# EAGLE design 304_usb_serial020000 (EAGLE 9.6.2)
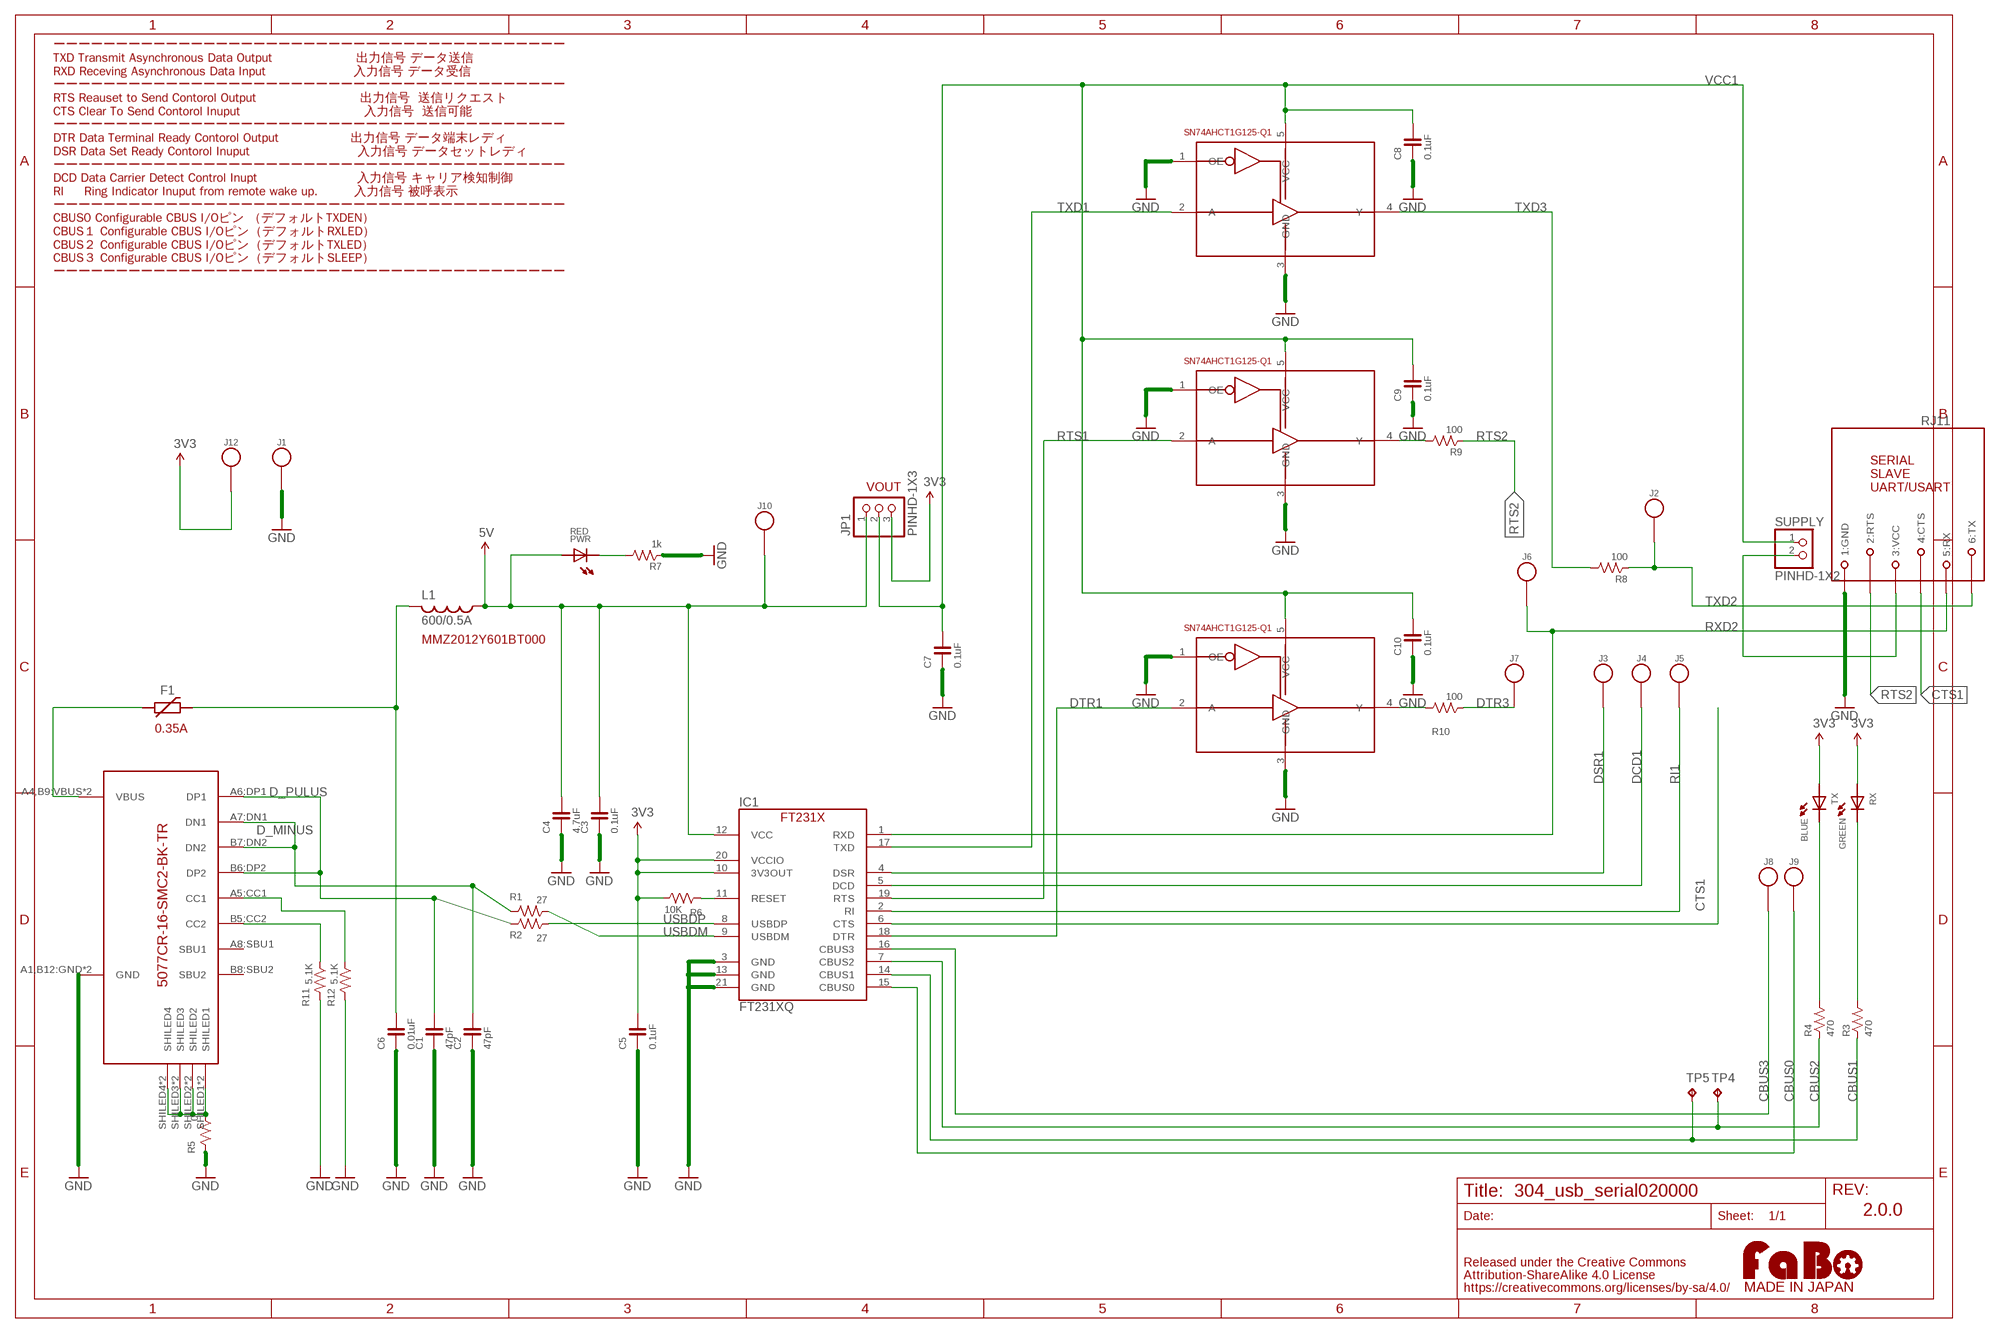
[diagram p0: schematic, sheet 1]

## Parts
C1  47pF  CAPACITOR-0603_NARROW  [0603-NARROW]
C2  47pF  CAPACITOR-0603_NARROW  [0603-NARROW]
C3  0.1uF  CAPACITOR-0603_NARROW  [0603-NARROW]
C4  4.7uF  CAPACITOR-0603_NARROW  [0603-NARROW]
C5  0.1uF  CAPACITOR-0603_NARROW  [0603-NARROW]
C6  0.01uF  CAPACITOR-0603_NARROW  [0603-NARROW]
C7  0.1uF  CAPACITOR-0603_NARROW  [0603-NARROW]
C8  0.1uF  CAPACITOR-0402-NO_SILK  [0402-NO_SILK]
C9  0.1uF  CAPACITOR-0402-NO_SILK  [0402-NO_SILK]
C10  0.1uF  CAPACITOR-0402-NO_SILK  [0402-NO_SILK]
F1  350mA  POLYSWITCH  [NANOSMDC035F]
IC1  FT231XQ  [QFN-20_FT231X]
J1  PIN_HEADER_1X1_NOLABEL_C  [PIN_1X1_NOLABEL]
J2  PIN_HEADER_1X1_NOLABEL_C  [PIN_1X1_NOLABEL]
J3  PIN_HEADER_1X1_NOLABEL_C  [PIN_1X1_NOLABEL]
J4  PIN_HEADER_1X1_NOLABEL_C  [PIN_1X1_NOLABEL]
J5  PIN_HEADER_1X1_NOLABEL_C  [PIN_1X1_NOLABEL]
J6  PIN_HEADER_1X1_NOLABEL_C  [PIN_1X1_NOLABEL]
J7  PIN_HEADER_1X1_NOLABEL_C  [PIN_1X1_NOLABEL]
J8  PIN_HEADER_1X1_NOLABEL_C  [PIN_1X1_NOLABEL]
J9  PIN_HEADER_1X1_NOLABEL_C  [PIN_1X1_NOLABEL]
J10  PIN_HEADER_1X1_NOLABEL_C  [PIN_1X1_NOLABEL]
J12  PIN_HEADER_1X1_NOLABEL_C  [PIN_1X1_NOLABEL]
JP1  PINHD-1X3  [1X03]
L1  600/0.5A  INDUCTOR_0805_L  [RESC0805_L]
PWR  RED  LED-0603-NARROW  [0603-NARROW]
R1  27  RESISTOR-0603-NARROW  [0603-NARROW]
R2  27  RESISTOR-0603-NARROW  [0603-NARROW]
R3  470  RESISTOR-0603-NARROW  [0603-NARROW]
R4  470  RESISTOR-0603-NARROW  [0603-NARROW]
R5  0  RESISTOR-0603-NARROW  [0603-NARROW]
R6  10K  RESISTOR-0603-NARROW  [0603-NARROW]
R7  1k  RESISTOR-0603-NARROW  [0603-NARROW]
R8  100  RESISTOR-0603-NARROW  [0603-NARROW]
R9  100  RESISTOR-0603-NARROW  [0603-NARROW]
R10  100  RESISTOR-0603-NARROW  [0603-NARROW]
R11  5.1K  RESISTOR-0603-NARROW  [0603-NARROW]
R12  5.1K  RESISTOR-0603-NARROW  [0603-NARROW]
RJ11  MODULAR-JACK-6P-RJ11_SERIAL_S_USART  [7002-6PXC-X]
RX  GREEN  LED-0603-NARROW  [0603-NARROW]
SUPPLY  PINHD-1X2  [1X02]
TP4  TPB0,65  [B0,65]
TP5  TPB0,65  [B0,65]
TX  BLUE  LED-0603-NARROW  [0603-NARROW]
U$2  LOGO_FABO-M_BOTTOM  [LOGO_FABO_MS_BOTTOM]
U$4  5077CR-16-SMC2-BK-TR  [5077CR-16-SMC2-BK-TR]
U$6  SN74AHCT1G125-Q1  [SC70]
U$7  SN74AHCT1G125-Q1  [SC70]
U$8  SN74AHCT1G125-Q1  [SC70]

## Nets
3V3: C5.2 IC1.10(3V3OUT) IC1.20(VCCIO) J12.1 JP1.3 R6.1 RX.ANODE TX.ANODE
5V: C3.2 C4.2 IC1.12(VCC) J10.1 JP1.1 L1.1 PWR.ANODE
CBUS0: IC1.15(CBUS0) J9.1
CBUS1: IC1.14(CBUS1) R3.1 TP5.TP
CBUS2: IC1.7(CBUS2) R4.1 TP4.TP
CBUS3: IC1.16(CBUS3) J8.1
CTS1: IC1.6(CTS) RJ11.4(4:CTS)
D_MINUS: C2.2 R1.2 U$4.A7:DN1(DN1) U$4.B7:DN2(DN2)
D_PULUS: C1.2 R2.2 U$4.A6:DP1(DP1) U$4.B6:DP2(DP2)
DCD1: IC1.5(DCD) J4.1
DSR1: IC1.4(DSR) J3.1
DTR1: IC1.18(DTR) U$8.2(A)
DTR3: J7.1 R10.1
GND: C1.1 C2.1 C3.1 C4.1 C5.1 C6.1 C7.1 C8.1 C9.1 C10.1 IC1.3(GND) IC1.13(GND) IC1.21(GND) J1.1 R5.2 R7.1 R11.2 R12.2 RJ11.1(1:GND) U$4.A1,B12:GND(GND) U$4.B1,A12:GND(GND) U$6.1(OE) U$6.3(GND) U$7.1(OE) U$7.3(GND) U$8.1(OE) U$8.3(GND)
N$1: R9.2 U$7.4(Y)
N$2: C6.2 F1.2 L1.2
N$3: R11.1 U$4.B5:CC2(CC2)
N$4: R12.1 U$4.A5:CC1(CC1)
N$5: PWR.CATHODE R7.2
N$8: R10.2 U$8.4(Y)
N$15: IC1.11(RESET) R6.2
N$33: R3.2 RX.CATHODE
N$35: R4.2 TX.CATHODE
RI1: IC1.2(RI) J5.1
RTS1: IC1.19(RTS) U$7.2(A)
RTS2: R9.1 RJ11.2(2:RTS)
RXD2: IC1.1(RXD) J6.1 RJ11.5(5:RX)
SHILED: R5.1 U$4.SHILED1 U$4.SHILED2 U$4.SHILED3 U$4.SHILED4 U$4.SHILED5(SHILED1) U$4.SHILED6(SHILED2) U$4.SHILED7(SHILED3) U$4.SHILED8(SHILED4)
TXD1: IC1.17(TXD) U$6.2(A)
TXD2: J2.1 R8.1 RJ11.6(6:TX)
TXD3: R8.2 U$6.4(Y)
USBDM: IC1.9(USBDM) R1.1
USBDP: IC1.8(USBDP) R2.1
VBUS: F1.1 U$4.A4,B9:VBUS(VBUS) U$4.B4,A9:VBUS(VBUS)
VCC1: C7.2 C8.2 C9.2 C10.2 JP1.2 SUPPLY.1 U$6.5(VCC) U$7.5(VCC) U$8.5(VCC)
VCC2: RJ11.3(3:VCC) SUPPLY.2
Unconnected: U$4.A8:SBU1(SBU1) U$4.B8:SBU2(SBU2)

## Notes on the sheet
- ーーーーーーーーーーーーーーーーーーーーーーーーーーーーーーーーーーーーーーーーー
  TXD Transmit Asynchronous Data Output                     出力信号 データ送信
  RXD Receving Asynchronous Data Input                      入力信号 データ受信
  ーーーーーーーーーーーーーーーーーーーーーーーーーーーーーーーーーーーーーーーーー
  RTS Reauset to Send Contorol Output                          出力信号  送信リクエスト
  CTS Clear To Send Contorol Inuput                               入力信号  送信可能 
  ーーーーーーーーーーーーーーーーーーーーーーーーーーーーーーーーーーーーーーーーー
  DTR Data Terminal Ready Contorol Output                  出力信号 データ端末レディ
  DSR Data Set Ready Contorol Inuput                           入力信号 データセットレディ
  ーーーーーーーーーーーーーーーーーーーーーーーーーーーーーーーーーーーーーーーーー
  DCD Data Carrier Detect Control Inupt                         入力信号 キャリア検知制御
  RI     Ring Indicator Inuput from remote wake up.         入力信号 被呼表示
  ーーーーーーーーーーーーーーーーーーーーーーーーーーーーーーーーーーーーーーーーー
  CBUS0 Configurable CBUS I/Oピン （デフォルトTXDEN）
  CBUS１ Configurable CBUS I/Oピン（デフォルトRXLED）
  CBUS２ Configurable CBUS I/Oピン（デフォルトTXLED）
  CBUS３ Configurable CBUS I/Oピン（デフォルトSLEEP）
  ーーーーーーーーーーーーーーーーーーーーーーーーーーーーーーーーーーーーーーーーー
- VOUT
- MMZ2012Y601BT000
- 0.35A
- 2.0.0

## Library data of the parts
C1-C10 = FaBo-Capacitor:CAPACITOR: CAPACITOR
F1 = FaBo-Parts:POLYSWITCH
IC1 = FaBo-USB:FT231X
J1-J10 J12 = FaBo-PIN:PIN_HEADER_1X1_NOLABEL_C
JP1 = Connector:PINHD-1X3: PIN HEADER; CATEGORY: CONNECTOR; SUB-CATEGORY: PIN-HEADER
L1 = Nordic_nRF:INDUCTOR: Generic chip inductor
PWR RX TX = FaBo-LED:LED
R1-R12 = FaBo-Resistors:RESISTOR: RESISTOR
RJ11 = FaBo-Connetor:MODULAR-JACK-6P-RJ11_SERIAL_S_USART
SUPPLY = Connector:PINHD-1X2: PIN HEADER; CATEGORY: CONNECTOR; SUB-CATEGORY: PIN-HEADER
TP4 TP5 = BeagleBone_Blue_R3:TP: Test pad
U$2 = FaBo-Logo:LOGO_FABO
U$4 = FaBo-USB:5077CR-16-SMC2-BK-TR
U$6-U$8 = FaBo-LevelTranslator:SN74AHCT1G125-Q1: SN74AHCT1G125-Q1 SINGLE BUFFER GATE WITH 3 STATE OUTPUT

## Board
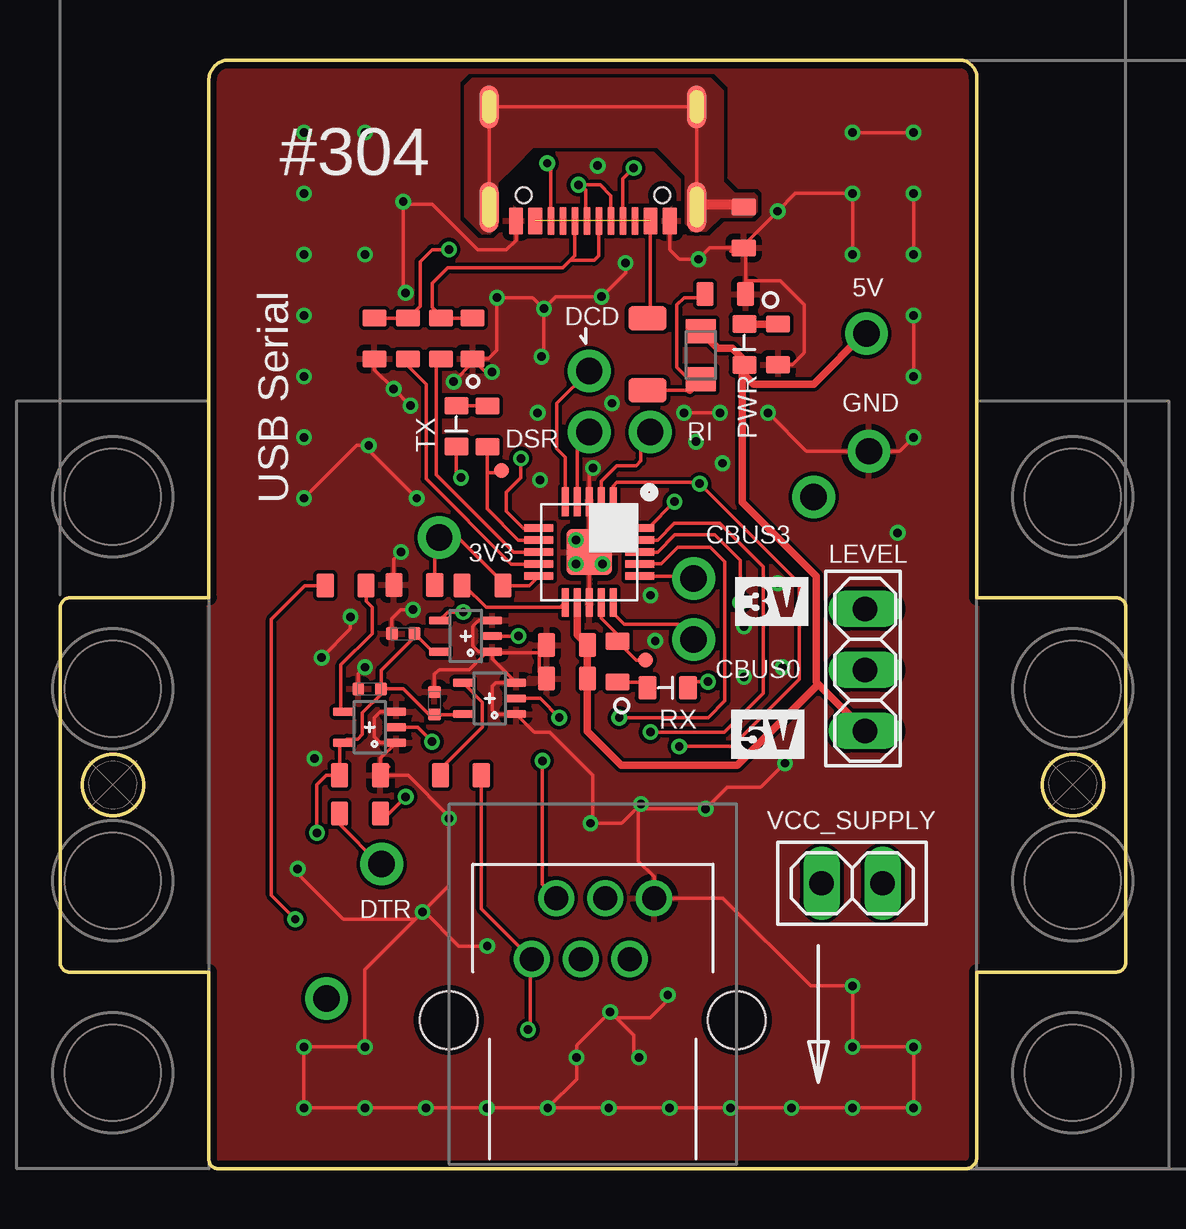
[diagram p1: board, top side]
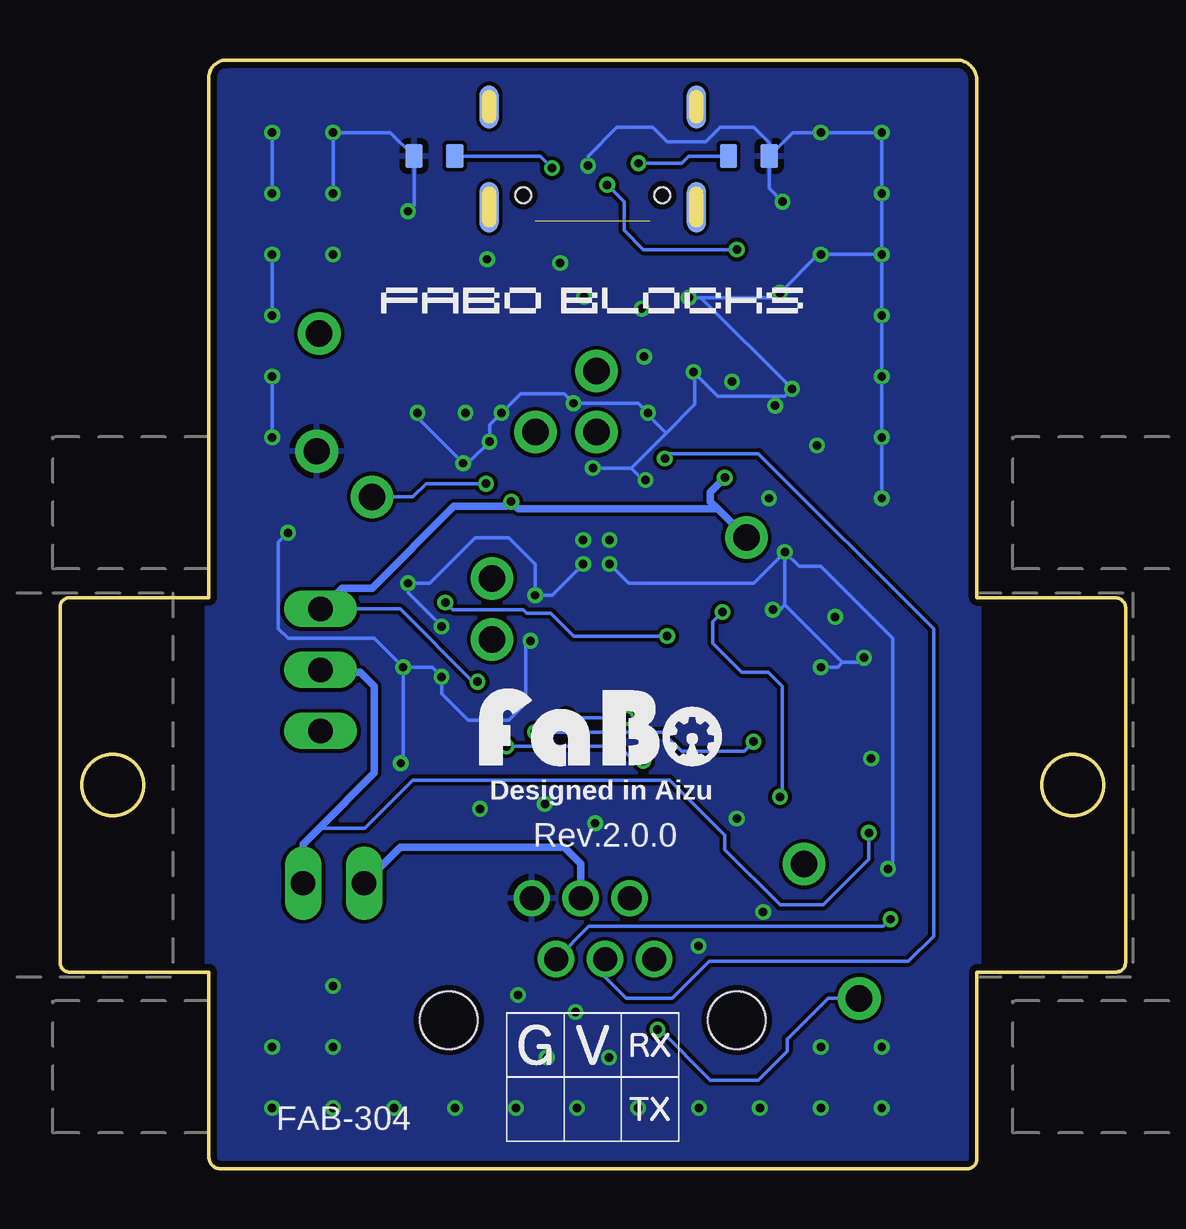
[diagram p2: board, bottom side, seen from below]

Size 44.4 x 46.2 mm. Coordinates in mm from the lower left corner, seen from the top.
Outline: 37.7,0 6.6,0 arc-90 6.2,0.4 6.2,8.2 0.4,8.2 arc-90 0,8.6 0,23.3 arc-90 0.4,23.8 6.2,23.8 6.2,45.4 arc-90 7.1,46.2 37.4,46.2 arc-99 38.2,45.4 38.2,23.8 44,23.8 arc-90 44.4,23.4 44.4,8.6 arc-90 44,8.2 38.2,8.2 38.2,0.5 arc-90 37.7,0
Outline: circle at 42.2,16 radius 1.27
Outline: circle at 2.2,16 radius 1.27
Copper layers (1*16): Top 0.035mm / dielectric 1.5mm / Bottom 0.035mm
Design rules "Elecrow_angle": minimum track width 6mil, minimum drill 12mil, track to track 6mil, track to pad 6mil, pad to pad 6mil, via to via 6mil, smd to smd 0mil, copper to edge 10mil, drill to drill 10mil, minimum pad ring 10mil, minimum via ring 6mil, stop-mask expansion 2mil, vias tented up to drill 100mil, thermal gap 10mil
tRestrict: area 38.3,6.6 to 46,26.2; area -1.6,6.6 to 6.1,26.2
bRestrict: area 38.4,6.6 to 46.1,26.2; area -1.7,6.6 to 6,26.2

### Footprints (pad centres in the part's own frame; a part is rotated, then mirrored left to right if it is on the bottom)
0603-NARROW = smd 0.71 x 1: 1 -0.85,0; 2 0.85,0
0402-NO_SILK = smd 0.5 x 0.55: 1 -0.475,0; 2 0.475,0
NANOSMDC035F = smd 1 x 1.6: 1 -1.5,0; 2 1.5,0
QFN-20_FT231X = smd 1.2 x 0.3: 1 -2.1,1; 2 -2.1,0.5; 3 -2.1,0; 4 -2.1,-0.5; 5 -2.1,-1; 11 2.1,-1; 12 2.1,-0.5; 13 2.1,0; 14 2.1,0.5; 15 2.1,1 | smd 0.3 x 1.2: 6 -1,-2.1; 7 -0.5,-2.1; 8 0,-2.1; 9 0.5,-2.1; 10 1,-2.1; 16 1,2.1; 17 0.5,2.1; 18 0,2.1; 19 -0.5,2.1; 20 -1,2.1 | smd 1.9 x 1.9: 21 0,0
PIN_1X1_NOLABEL = drill 1.1 pad 1.778: 1 0,0
1X03 = drill 1.016 long: 1 -2.54,0; 2 0,0; 3 2.54,0
RESC0805_L = smd 1 x 1.25: 1 -1,0; 2 1,0
0603-NARROW' = smd 0.75 x 1: ANODE -0.85,0; CATHODE 0.85,0
7002-6PXC-X = drill 1: 1 2.55,5.08; 2 1.53,2.54; 3 0.51,5.08; 4 -0.51,2.54; 5 -1.53,5.08; 6 -2.55,2.54 | hole 2.4: -6,0; 6,0
1X02 = drill 1.016 long: 1 -1.27,0; 2 1.27,0
B0,65 = smd 0.635 x 0.635: TP 0,0
5077CR-16-SMC2-BK-TR = smd 0.6 x 1.14: A1,B12:GND -3.2,0; A4,B9:VBUS -2.4,0; B1,A12:GND 3.2,0; B4,A9:VBUS 2.4,0 | smd 0.3 x 1.14: A5:CC1 -1.25,0; A6:DP1 -0.25,0; A7:DN1 0.25,0; A8:SBU1 1.25,0; B5:CC2 1.75,0; B6:DP2 0.75,0; B7:DN2 -0.75,0; B8:SBU2 -1.75,0 | smd 0.8 x 2.1: SHILED1 -4.32,-0.57; SHILED2 4.32,-0.57 | smd 0.8 x 1.8: SHILED3 -4.32,-4.75; SHILED4 4.32,-4.75 | smd 0.8 x 2.1 bottom: SHILED5 -4.32,-0.57; SHILED7 4.32,-0.57 | smd 0.8 x 1.8 bottom: SHILED6 -4.32,-4.75; SHILED8 4.32,-4.75 | hole 0.65: -2.89,-1.07; 2.89,-1.07
SC70 = smd 0.35 x 0.85: 1 -0.65,-1.1; 2 0,-1.1; 3 0.65,-1.1; 4 0.65,1.1; 5 -0.65,1.1

### Placement (x,y rotation side)
C1  17.19,34.6 90 top
C2  13.1,34.6 90 top
C3  21.13,21.82 0 top
C4  21.12,20.43 0 top
C5  14.76,24.34 0 top
C6  27.72,36.45 180 top
C7  12.5,16.4 180 top
C8  12.9,20 0 top
C9  15.6,19.4 270 top
C10  14.3,22.3 0 top
F1  24.48,33.95 270 top
IC1  22.05,25.7 270 top
J1  33.7,29.9 0 top
J2  11.1,7.1 0 top
J3  22.05,30.7 0 top
J4  22.05,33.24 0 top
J5  24.59,30.7 0 top
J6  31.4,28 0 top
J7  13.4,12.7 0 top
J8  26.4,24.6 0 top
J9  26.4,22.06 0 top
J10  33.6,34.8 0 top
J12  15.8,26.3 0 top
JP1  33.55,20.79 90 top
L1  26.7,33.9 270 top
PWR  RED  [0603-NARROW']  28.52,34.34 90 top
R1  14.5,34.6 90 top
R2  15.87,34.6 90 top
R3  23.22,21.14 270 top
R4  17.82,30.93 90 top
R5  28.49,39.23 270 top
R6  17.6,24.3 180 top
R7  29.92,34.35 90 top
R8  16.7,16.4 180 top
R9  11.9,24.3 0 top
R10  12.5,14.8 0 top
R11  15.7,42.2 0 bottom
R12  28.8,42.2 180 bottom
RJ11  22.2,6.2 0 top
RX  GREEN  [0603-NARROW']  25.32,20.05 180 top
SUPPLY  33,11.9 180 top
TP4  18.4,29.1 0 top
TP5  24.4,21.2 0 top
TX  BLUE  [0603-NARROW']  16.52,30.95 90 top
U$2  21.87,16.4 0 top
U$3  [4-1BLOCK]  2.2,16 0 top
U$4  22.2,39.5 180 top
U$5  [4-1BLOCK]  42.2,16 0 top
U$6  17.9,19.6 90 top
U$7  12.9,18.4 90 top
U$8  16.9,22.2 90 top

### Tracks (layer width: path | path; a pad name or v marks a point on that pad's centre or on a via)
3V3  (via drill 0.35)
  Top 0.152: IC1.20 24.5,26.7 v25.6,27.8 | IC1.10 19.55,24.3 R6.1 18.45,24.45 16.6,26.3 J12.1 15.61,26.11 C5.2 | RX.ANODE 26.43,20.3 v27,20.3 | TX.ANODE 16.52,28.98 v16.7,28.8
  Bottom 0.152: v27,20.3 27.2,20.3 30.23,23.33 33.5,23.33 JP1.3
  Bottom 0.305: 33.5,23.33 32.63,24.2 31.4,24.2 28,27.6 25.8,27.6 v25.6,27.8 25.3,27.5 17,27.5 | 17,27.5 17.3,27.8 17.3,28.2 v16.7,28.8 | 17,27.5 J12.1
5V
  Top 0.152: C3.2 21.95,21.85 21.78,22.02 | IC1.12 21.57,23.58 | C4.2 22,20.4 22,20.39
  Top 0.305: 31.6,20.2 31.5,20.3 31.5,24.7 28.42,27.79 28.42,33.19 28.52,33.09 | 31.6,20.2 JP1.1 | PWR.ANODE 28.21,33.49 | IC1.12 21.55,22.25 21.95,21.85 | C3.2 C4.2 22,20.4 | C4.2 21.97,18.23 23.38,16.82 28.22,16.82 31.6,20.2 | J10.1 33.6,34.9 31.4,32.7 28.9,32.7 28.52,33.09 | 28.52,33.09 PWR.ANODE | L1.1 27.4,34.2 28,34.2 28.52,33.69 PWR.ANODE
CBUS0
  Top 0.152: IC1.15 23.1,23.55 23.1,23.1 23.5,22.7 25.76,22.7 J9.1
CBUS1
  Top 0.152: IC1.14 22.55,22.95 23.22,22.28 R3.1 24.01,21.2 TP5.TP
CBUS2
  Top 0.152: 17.82,30.29 R4.1 17.8,30.07 17.8,29 | IC1.7 19.1,26.2 17.8,27.5 17.8,29 | TP4.TP 18.3,29 17.8,29
CBUS3
  Top 0.152: IC1.16 26.3,24.7 J8.1
CTS1  (via drill 0.35)
  Top 0.152: IC1.6 19.3,26.7 18.6,27.4 18.6,28.2 19.2,28.8 v19.2,29.6
  Bottom 0.152: v19.2,29.6 19,29.8 15.3,29.8 8,22.5 8,9.7 9.05,8.65 17.35,8.65 18.9,7.1 20.8,7.1 21.69,7.99 RJ11.4
D_MINUS  (via drill 0.35)
  Top 0.152: C2.2 R1.2 15,35.95 15,37.8 15.51,38.31 v16.2,38.31 | v21.6,41 21.7,41 | 21.7,41 22.5,41 22.95,40.55 U$4.B7:DN2 | U$4.A7:DN1 21.9,39.55 21.9,40.8 21.7,41
  Bottom 0.152: v16.2,38.31 20.11,38.31 20.9,39.1 20.9,40.3 v21.6,41
D_PULUS
  Top 0.152: C1.2 R2.2 15.87,35.53 15.5,35.9 15.5,36.9 16.15,37.55 20.95,37.55 21.25,37.85 | U$4.B6:DP2 21.45,38.05 21.25,37.85 | U$4.A6:DP1 22.45,38.05 22.25,37.85 21.25,37.85
DCD1
  Top 0.152: IC1.5 21.05,29.65 20.7,30 20.7,31.9 J4.1
DSR1
  Top 0.152: IC1.4 21.55,30.2 J3.1
DTR1  (via drill 0.35)
  Top 0.152: IC1.18 24.9,25.7 25.62,26.42 27.28,26.42 28.35,25.36 v28.35,23.6 | U$8.2 v19.1,22.2
  Bottom 0.152: v28.35,23.6 28.05,23.3 25.1,23.3 24.95,23.15 23.95,23.15 23,22.2 v19.1,22.2
DTR3
  Top 0.152: R10.1 11.65,14.35 13.3,12.7 J7.1
GND  (via drill 0.35)
  Top 0.152: 12.95,33.45 12.8,33.45 C2.1 13.1,33.3 v13.9,32.5 v14.6,31.8 | IC1.13 IC1.21 | 19.98,21.5 19.98,21.9 20.28,21.6 C3.1 19.95,21.5 18,21.5 | 19.98,21.5 19.98,20.72 C4.1 | C7.1 13.1,16.65 | 13.7,16.75 C7.1 | 20,20.7 C4.1 | 17.22,33.72 C1.1 17.85,33.75 18.2,34.1 v18.2,36.3 19.7,36.3 v20.16,35.84 | 17.22,33.72 17.74,33.2 v18,33.2 | v22.2,29.2 22.05,29.05 IC1.3 IC1.21 | IC1.21 22.55,26.2 v22.6,26.2 | IC1.21 22.1,25.7 v22.6,25.2 | IC1.21 21.55,25.2 v21.5,25.2 | v14.2,25.7 13.91,25.41 C5.1 | 30.5,33.5 30.5,33.51 R7.1 30.51,33.51 31,34 31,36 30,37 28.57,37 | v9.9,12.5 9.9,12.3 11.8,10.4 14.8,10.4 v15.1,10.7 | IC1.21 21.55,26.2 v21.5,26.2 | v26,31.5 v27.5,31.5 | v30.2,16.9 29.2,15.9 27.8,15.9 v26.9,15 24.4,15 v24.2,15.2 | v24.2,15.2 23.4,14.4 22.2,14.4 | 22.2,14.4 v22.1,14.4 | v24.2,15.2 24.1,15.1 24.1,12.82 24.75,12.18 RJ11.1 27.62,11.28 31.28,7.62 v33.02,7.62 v33.02,5.08 v35.56,5.08 v35.56,2.54 v33.02,2.54 v30.48,2.54 v27.94,2.54 v25.4,2.54 v22.86,2.54 v20.32,2.54 | 14.28,36.38 v14.4,36.5 14.3,36.6 14.3,40.2 | v16.4,32.8 17.22,33.62 17.22,33.72 | 15.15,10.75 16.2,11.8 v16.2,14.6 16.2,14.7 14.5,16.4 C7.1 | 15.15,10.75 v15.1,10.7 | 20.1,20.6 C4.1 | 19.8,21.5 19.98,21.5 | 17.8,21.55 U$8.1 18,21.5 | 17.8,21.55 17.45,21.55 17.2,21.8 17.2,22.6 17.45,22.85 U$8.3 | U$7.3 13.35,19.05 13.1,18.8 13.1,18 13.35,17.75 U$7.1 13.35,17.1 C7.1 | C10.1 13.83,22.93 14.2,23.3 v14.7,23.3 | C8.1 12.43,20.62 v12.7,20.9 | 18,21.5 18,21.25 U$6.3 18.15,20.25 18,20.1 18,19.1 18.15,18.95 U$6.1 19.75,18.2 20.4,18.2 22.2,16.4 22.2,14.4 | v12.1,23 12.1,22.5 v10.9,21.3 | C9.1 15.6,20.6 15.8,20.8 17.05,20.8 17.8,21.55 | U$4.A1,B12:GND 25.4,38.3 25.8,37.9 v26.6,37.9 27.08,38.38 R5.2 28.57,38.3 C6.1
  Top 0.152: 27.94,38.24 28.24,38.24 v29.9,39.9 30.64,40.64 v33.02,40.64 v33.02,38.1 | v14.3,40.3 14.3,40.2 | U$4.B1,A12:GND 19,38.7 18.6,38.3 17.4,38.3 15.5,40.2 14.3,40.2 | v29.5,31.5 31.1,29.9 J1.1 34.98,29.9 v35.56,30.48 | v33.02,43.18 v35.56,43.18 | v35.56,40.64 v35.56,38.1 | v35.56,35.56 v35.56,33.02 | v10.16,27.94 12.36,30.14 v12.86,30.14 12.86,29.94 v14.86,27.94 | v20.16,35.84 20.16,33.94 v20.06,33.84 | v20.16,35.84 20.66,36.34 v22.56,36.34 23.56,37.34 v23.56,37.74 | v12.7,5.08 12.7,5.1 | 12.7,5.1 12.7,8.3 v15.1,10.7 | 12.7,5.1 12.68,5.08 v10.16,5.08 v10.16,2.54 v12.7,2.54 v15.24,2.54 v17.78,2.54 v20.32,2.54 | v22.92,6.54 21.52,5.14 v21.52,4.64 21.52,3.74 v20.32,2.54 | v22.92,6.54 23.9,5.56 23.9,4.86 v24.12,4.64 | v25.32,7.24 25.32,7.02 24.6,6.3 23.16,6.3 v22.92,6.54 | v17.8,9.28 16.62,9.28 15.15,10.75
  Bottom 0.152: v18,33.2 17.95,33.15 | 17.95,33.15 17,32.2 14.2,32.2 v13.9,32.5 17.7,36.3 v18.2,36.3 14.6,36.3 v14.4,36.5 12.8,38.1 v12.7,38.1 v10.16,38.1 | v22.2,29.2 20.6,29.2 | 17.95,33.15 17.95,31.85 19.15,30.65 | 20.6,29.2 19.15,30.65 | 14.2,23.5 11.8,21.1 | v14.2,25.7 14.2,23.5 | v21.5,25.2 20.7,24.4 15.5,24.4 v14.2,25.7 | v14.2,25.7 13.6,25.1 12.7,25.1 9.7,22.1 9.7,12.8 9.9,12.6 v9.9,12.5 | 14,25.5 v14.2,25.7 | v20,28.7 20.1,28.7 20.6,29.2 | 19.15,30.65 19.9,31.4 v19.9,31.5 20.3,31.9 v23,31.9 23.4,32.3 25.2,32.3 v26,31.5 26.5,31 v26.5,30.3 27.3,29.5 27.5,29.5 v27.6,29.4 29.5,31.3 v29.5,31.5 | v22.6,25.2 23.9,23.9 v24.6,23.9 24.6,25.2 25.7,26.3 27.1,26.3 29,24.4 v29.9,24.4 29.9,24 v28.5,22.6 | v24.8,22 25,21.8 25,19.4 25.7,18.7 27.4,18.7 28.5,19.8 v28.5,20.5 28.9,20.9 v30.1,20.9 | v30.1,20.9 30.1,17 v30.2,16.9 | v30.1,20.9 31.3,22.1 34.9,22.1 35.3,22.5 35.3,26.1 v34.9,26.5 | 14.2,23.5 14.4,23.3 v14.7,23.3 | v12.7,20.9 12,20.9 11.8,21.1 | 11.8,21.1 11.1,21.1 v10.9,21.3 | v29.9,39.9 29.65,40.15 R12.2 30.63,43.18 v33.02,43.18 v33.02,40.64 | R11.2 14.85,40.85 v14.3,40.3 | v35.56,43.18 v35.56,40.64 | v35.56,38.1 v35.56,35.56 | v35.56,33.02 v35.56,30.48 | v10.16,27.94 v10.16,30.48 v10.16,33.02 v10.16,35.56 v10.16,38.1 | v10.16,38.1 v10.16,40.64 v10.16,43.18 v12.7,43.18 13.87,43.18 R11.2 | R11.2 14.85,42.75 15.5,43.4 16.9,43.4 17.5,42.8 19.1,42.8 19.7,43.4 21.2,43.4 22.4,42.2 v22.4,41.8
  other vias: 10.6,17.1
  pour Bottom: -3.5,-1.5 47.04,-1.5 47.04,48 -3.5,48
  pour Top (rank 6): -2.7,-1.2 47.24,-1.2 47.24,47.7 -2.7,47.7
N$1
  Top 0.152: R9.2 12.75,23.65 13,23.4 13,22.3 11.7,21 11.7,19.15 U$7.4
N$2
  Top 0.152: F1.2 26.25,32.45 | C6.2 26.72,36.3 26,36.3 25.7,36 25.7,33.4 26.45,32.65
  Top 0.305: 26.25,32.45 26.45,32.65 L1.2
N$3  (via drill 0.35)
  Top 0.152: U$4.B5:CC2 20.45,41.75 v20.3,41.9
  Bottom 0.152: v20.3,41.9 18.5,41.9 18.2,42.2 R11.1
N$4  (via drill 0.35)
  Top 0.152: v23.9,41.7 23.45,41.25 U$4.A5:CC1
  Bottom 0.152: R12.1 24.4,42.2 v23.9,41.7
N$5
  Top 0.305: R7.2 PWR.CATHODE
N$8  (via drill 0.35)
  Top 0.152: 16.15,22.85 U$8.4 16.15,23.2 v16.8,23.2 | v14.4,15.5 13.7,14.8 R10.2
  Bottom 0.152: v14.4,15.5 14.3,15.6 14.3,20.1 14.9,20.7 16,20.7 17.2,21.9 17.2,22.8 v16.8,23.2
N$15
  Top 0.152: 16.7,24.25 R6.2 16.85,24.3 17.75,23.4 20.85,23.4 IC1.11
N$33
  Top 0.152: RX.CATHODE 24.23,20.29 R3.2
N$35
  Top 0.152: 16.53,31.79 TX.CATHODE 17.81,31.8 R4.2
RI1
  Top 0.152: IC1.2 22.55,28.65 23.2,29.3 24,29.3 24.2,29.5 24.2,30.4 24.29,30.4 J5.1
RTS1  (via drill 0.35)
  Top 0.152: IC1.19 24.9,26.2 25.6,26.9 27.48,26.9 29.3,25.08 29.3,19.82 27.68,18.2 v24.6,18.2 | v15.5,17.8 14.9,18.4 U$7.2
  Bottom 0.152: v24.6,18.2 19.3,18.2 18.5,17.4 15.9,17.4 v15.5,17.8
RTS2  (via drill 0.35)
  Top 0.152: v9.8,10.4 8.8,11.4 8.8,22.9 10.2,24.3 R9.1
  Bottom 0.152: RJ11.2 22.37,10.1 10.1,10.1 v9.8,10.4
RXD2  (via drill 0.35)
  Top 0.152: IC1.1 23.05,28.45 23.2,28.6 26.6,28.6 v26.65,28.55 30.8,24.4 30.8,20.4 28,17.6 v25.8,17.6 | v20.1,17 20.1,11.85 RJ11.5
  Bottom 0.152: v25.8,17.6 21.1,17.6 20.5,17 v20.1,17 | J6.1 29.7,28 29.15,28.55 v26.65,28.55
SHILED  (4 unrouted)
  Top 0.152: U$4.SHILED2 U$4.SHILED4 U$4.SHILED6 U$4.SHILED5
  Top 0.406: 26.5,39.9 26.8,40.2 28.36,40.2 R5.1
  pour Top (no thermals): 17.9,39 17.6,39 17.3,39.3 16.9,39.7 16.9,45.1 17.2,45.4 18,45.4 27.1,45.4 27.6,44.9 27.6,41.1 27.9,40.8 28.1,40.6 28.9,40.6 29,40.5 29,40.4 29,39.9 28.8,39.7 27.5,39.7 26.9,39.1 26.3,39.1 26.3,39.2 26.1,39.4 26.1,41.4 24.9,42.6 19.7,42.6 18.9,41.8 18.2,41.1 18.2,39.3
TXD1  (via drill 0.35)
  Top 0.152: IC1.17 24.17,25.22 25.05,25.22 25.73,25.9 27.1,25.9 27.7,25.3 27.7,19.5 27,18.8 v23.3,18.8 | v20.8,18.8 20,19.6 U$6.2
  Bottom 0.152: v23.3,18.8 v20.8,18.8
TXD2  (via drill 0.35)
  Top 0.152: RJ11.6 19.6,8.79 | 19.6,8.79 17.55,10.84 R8.1 | v19.5,5.8 19.6,5.89 19.6,8.79
  Bottom 0.152: J2.1 12.4,7.1 14.1,5.4 14.1,4.9 15.3,3.7 17.3,3.7 19.4,5.8 v19.5,5.8
TXD3
  Top 0.152: 15.9,16.45 R8.2 15.85,16.65 17.6,18.4 17.6,19.45 U$6.4
USBDM
  Top 0.152: 14.5,33.85 R1.1 14.5,33.45 15.25,32.7 15.25,28.75 18.8,25.2 IC1.9
USBDP
  Top 0.152: R2.1 15.67,33.55 15.67,28.93 18.9,25.7 IC1.8
VBUS  (1 unrouted)
  Top 0.152: U$4.A4,B9:VBUS 24.6,35.57 F1.1
VCC1  (via drill 0.35)
  Top 0.152: C7.2 11.65,16.75 | U$8.5 15.53,21.55 C10.2 14.78,22.18 13.38,20.77 C8.2 13.4,20 | U$6.5 16.78,18.93 C9.2 15.38,18.93 14.3,20 13.4,20 | 13.4,20 13.4,19.8 12.6,19 12.6,18.1 12.4,17.9 11.95,17.9 U$7.5 11.65,17.6 C7.2 | v10.7,14 10.7,16 11.1,16.4 C7.2
  Bottom 0.152: v10.7,14 10.7,12.9 12.6,11 14.4,11 16.7,13.3 16.7,13.9 19,16.2 29.7,16.2 31.7,14.2 33.6,14.2 33.65,14.15
  Bottom 0.305: JP1.2 33.46,20.7 31.9,20.7 31.3,20.1 31.3,16.5 33.65,14.15 34.27,13.53 SUPPLY.1
VCC2
  Bottom 0.305: RJ11.3 22.71,12.71 23.4,13.4 30.23,13.4 SUPPLY.2

### Text on the board
tPlace: #304 | 5V | DCD | GND | DSR | RI | USB Serial | 3V3 | CBUS3 | LEVEL | CBUS0 | VCC_SUPPLY | DTR
bPlace: Designed in Aizu | Rev.2.0.0 | FAB-304
tDocu: #304 USB Serial FaBo BLOCKS Rev2.0.0 / 2022/08/10